# Altium project PROC101D_SCH_With_Design_Updates..Notes_V1.0.PrjPcb (part 13 of 23)

## Sheet 29.SchDoc
size 513 x 386 mm
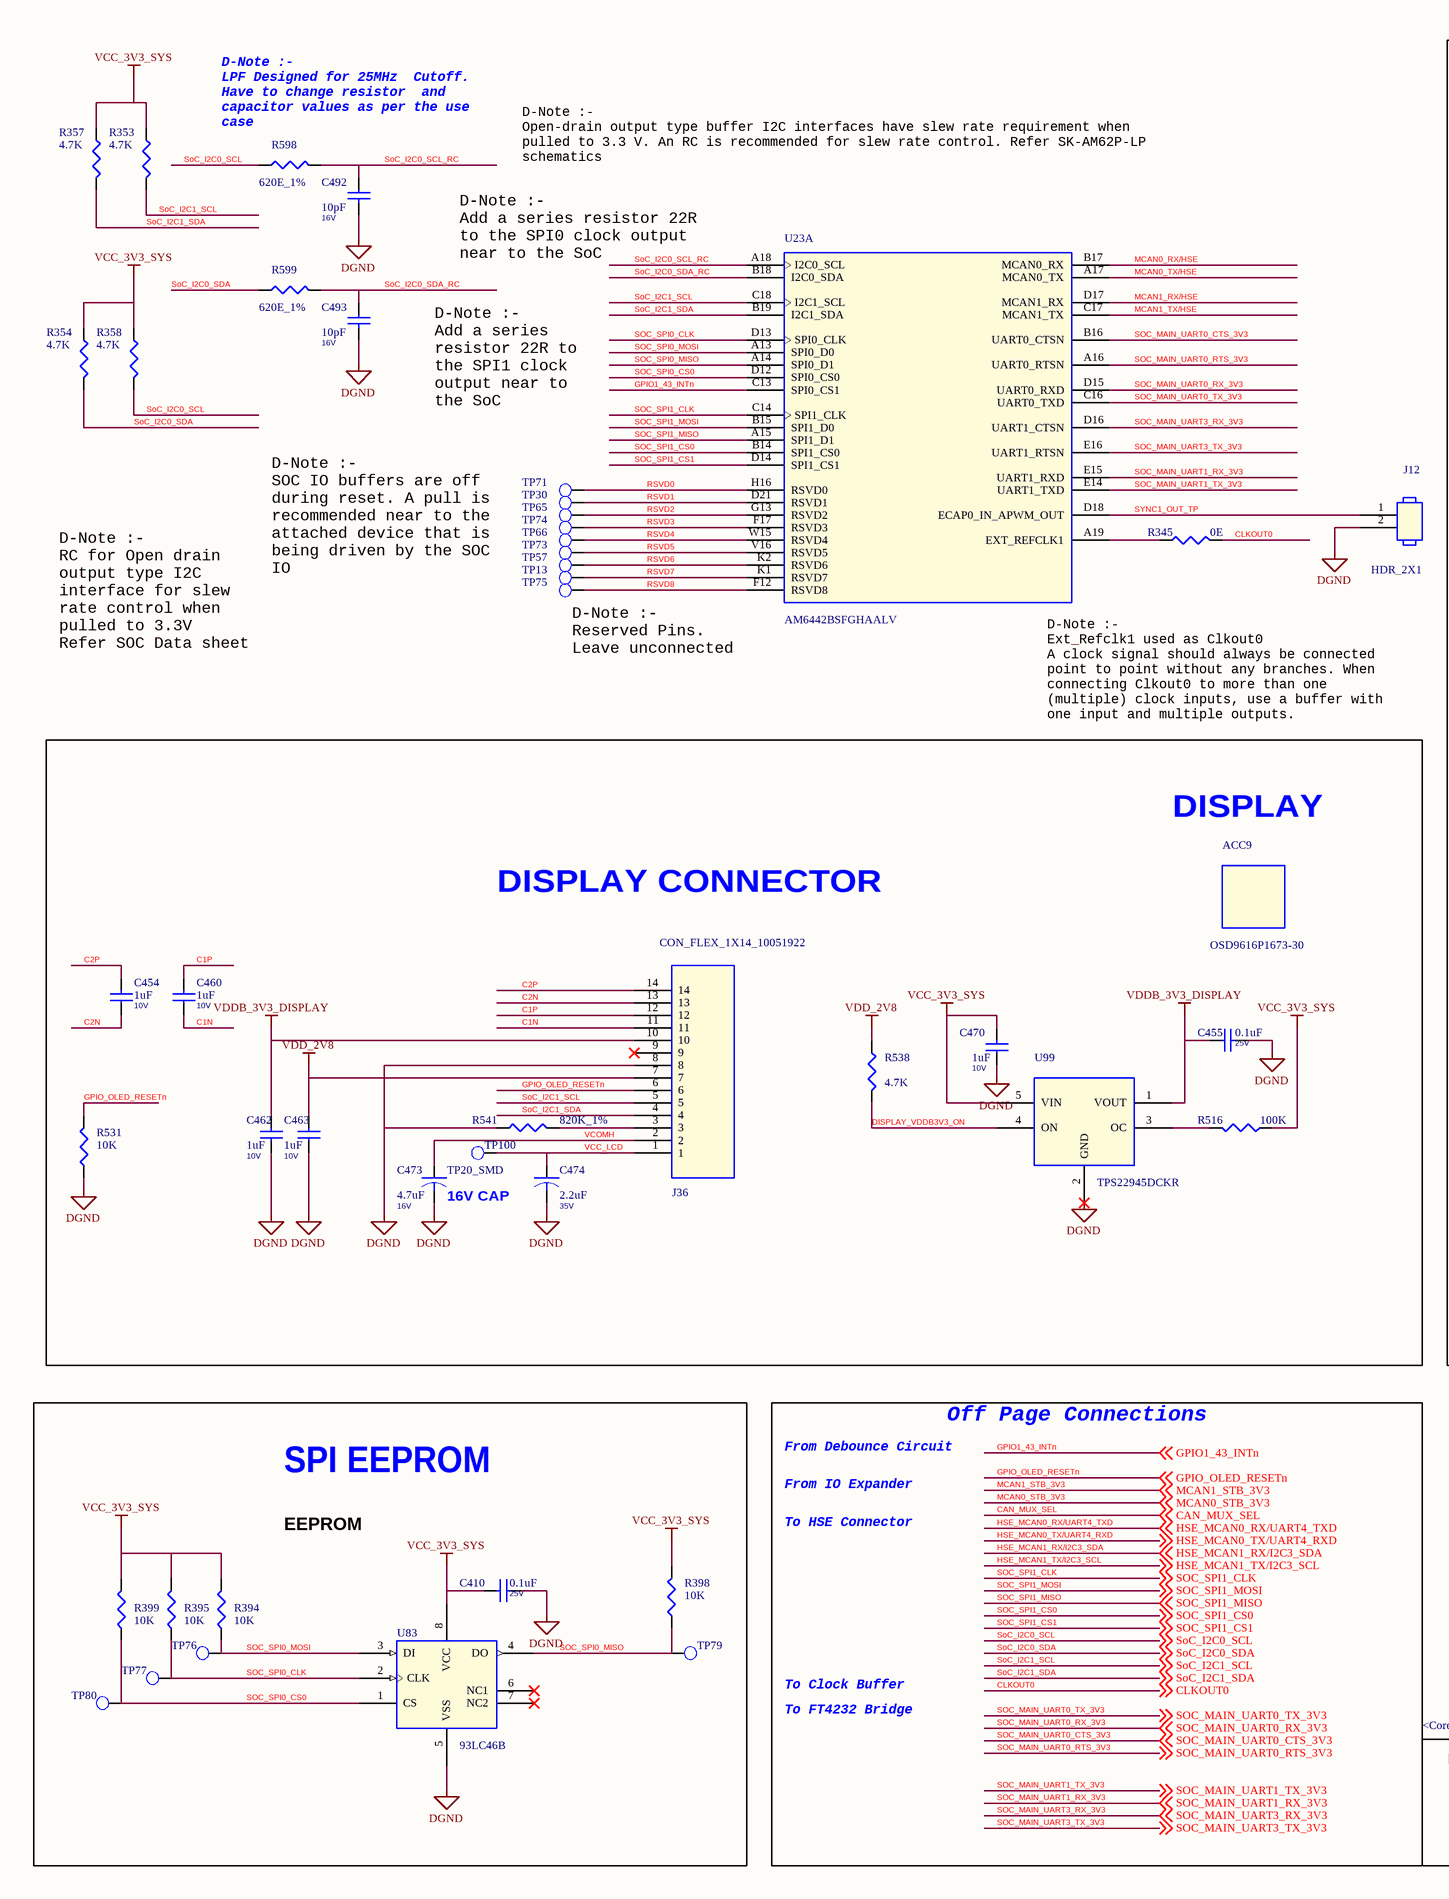
[diagram p52: 29.SchDoc, left]
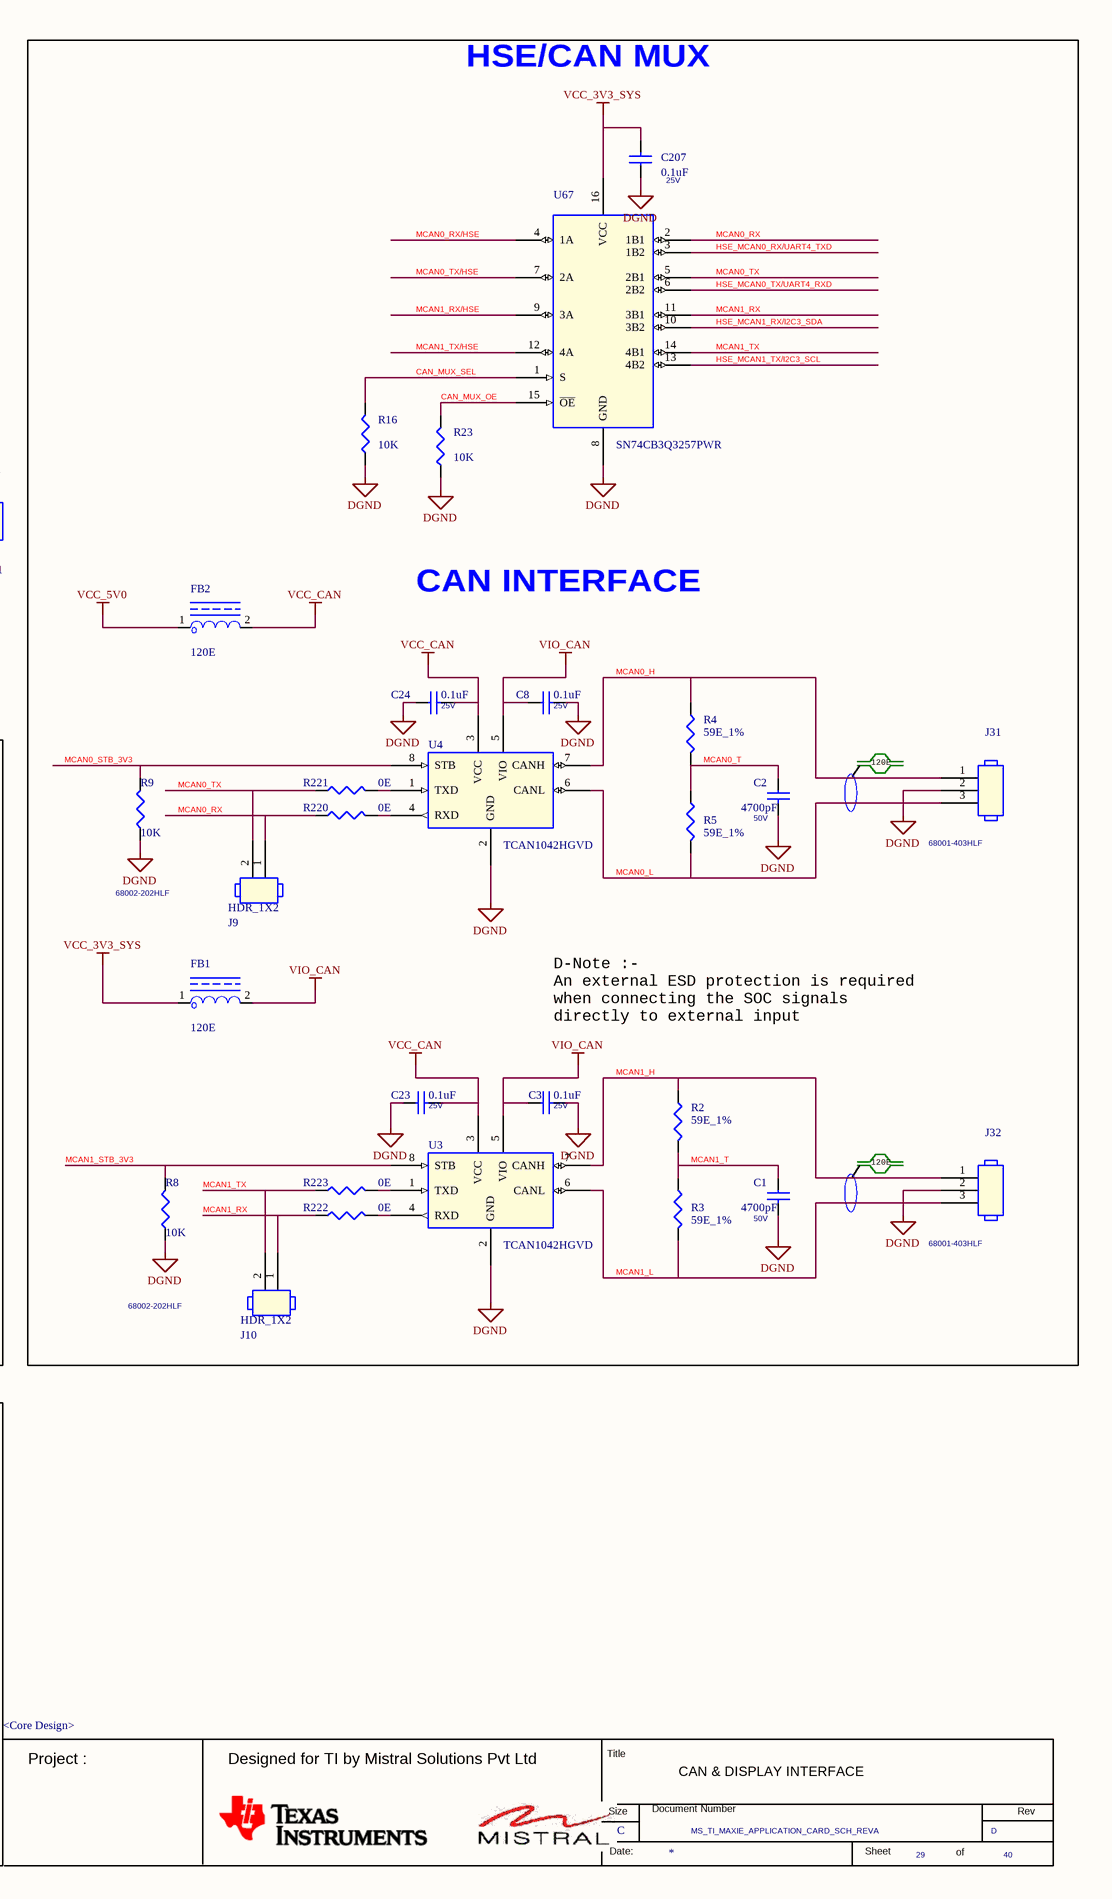
[diagram p53: 29.SchDoc, right]

### Parts
(Parts that share a designator on the sheet are numbered #1, #2 ... from top to bottom, then left to right.)
*#29  Doc: MS_TI_MAXIE_APPLICATION_CARD_SCH_REVA  RevCode: D  Title: CAN & DISPLAY INTERFACE  Page Size: C  Page Number: 29  Page Count: 40  Variant Name: <Core Design>  (hidden comment: TI_TITLEBLK_CSIZE)  (graphical)
ACC9  OSD9616P1673-30  [NA]
C1  4700pF  Voltage: 50V  [CAP0402_0-75]
C2  4700pF  Voltage: 50V  [CAP0402_0-75]
C3  0.1uF  Voltage: 25V  [CAP0402_0-75]
C8  0.1uF  Voltage: 25V  [CAP0402_0-75]
C23  0.1uF  Voltage: 25V  [CAP0402_0-75]
C24  0.1uF  Voltage: 25V  [CAP0402_0-75]
C207  0.1uF  Voltage: 25V  [CAP0402_0-75]
C410  0.1uF  Voltage: 25V  [CAP0402_0-75]
C454  1uF  Voltage: 10V  [CAP0402_0-75]
C455  0.1uF  Voltage: 25V  [CAP0402_0-75]
C460  1uF  Voltage: 10V  [CAP0402_0-75]
C462  1uF  Voltage: 10V  [CAP0402_0-75]
C463  1uF  Voltage: 10V  [CAP0402_0-75]
C470  1uF  Voltage: 10V  [CAP0402_0-75]
C473  4.7uF  Voltage: 16V  [CAP0603_1]
C474  2.2uF  Voltage: 35V  [CAP0603_1]
C492  10pF  Voltage: 16V  [CAP0402_0-75]
C493  10pF  Voltage: 16V  [CAP0402_0-75]
FB1  120E  [IND0603_1]
FB2  120E  [IND0603_1]
J9  HDR_1X2  Mfr_part_number: 68002-202HLF  [HDR_1X2_68002-202_S_T_8-6]
J10  HDR_1X2  Mfr_part_number: 68002-202HLF  [HDR_1X2_68002-202_S_T_8-6]
J12  HDR_2X1  [HDR_2X1_100_S_T]
J31  Mfr_part_number: 68001-403HLF  [HDR_3X1_100_S_T]  (hidden comment: HDR_1X3)
J32  Mfr_part_number: 68001-403HLF  [HDR_3X1_100_S_T]  (hidden comment: HDR_1X3)
J36  CON_FLEX_1X14_10051922  [CON_FLEX1X14_10051922_S_R_S]
R2  59E_1%  [RES0402_0-5]
R3  59E_1%  [RES0402_0-5]
R4  59E_1%  [RES0402_0-5]
R5  59E_1%  [RES0402_0-5]
R8  10K  [RES0402_0-5]
R9  10K  [RES0402_0-5]
R16  10K  [RES0402_0-5]
R23  10K  [RES0402_0-5]
R220  0E  [RES0402_0-5]
R221  0E  [RES0402_0-5]
R222  0E  [RES0402_0-5]
R223  0E  [RES0402_0-5]
R345  0E  [RES0402_0-5]
R353  4.7K  [RES0402_0-5]
R354  4.7K  [RES0402_0-5]
R357  4.7K  [RES0402_0-5]
R358  4.7K  [RES0402_0-5]
R394  10K  [RES0402_0-5]
R395  10K  [RES0402_0-5]
R398  10K  [RES0402_0-5]
R399  10K  [RES0402_0-5]
R516  100K  [RES0402_0-5]
R531  10K  [RES0402_0-5]
R538  4.7K  [RES0402_0-5]
R541  820K_1%  [RES0402_0-5]
R598  620E_1%  [RES0402_0-5]
R599  620E_1%  [RES0402_0-5]
TP13  TP20_SMD  [TP20_SMD]  (value not drawn)
TP30  TP20_SMD  [TP20_SMD]  (value not drawn)
TP57  TP20_SMD  [TP20_SMD]  (value not drawn)
TP65  TP20_SMD  [TP20_SMD]  (value not drawn)
TP66  TP20_SMD  [TP20_SMD]  (value not drawn)
TP71  TP20_SMD  [TP20_SMD]  (value not drawn)
TP73  TP20_SMD  [TP20_SMD]  (value not drawn)
TP74  TP20_SMD  [TP20_SMD]  (value not drawn)
TP75  TP20_SMD  [TP20_SMD]  (value not drawn)
TP76  TP20_SMD  [TP20_SMD]  (value not drawn)
TP77  TP20_SMD  [TP20_SMD]  (value not drawn)
TP79  TP20_SMD  [TP20_SMD]  (value not drawn)
TP80  TP20_SMD  [TP20_SMD]  (value not drawn)
TP100  TP20_SMD  [TP20_SMD]
U3  TCAN1042HGVD  [SOIC8_1-8]
U4  TCAN1042HGVD  [SOIC8_1-8]
U23  AM6442BSFGHAALV  [FCBGA441_31-49_680X680_2-6]  (part A of 16)
U67  SN74CB3Q3257PWR  [TSSOP16_25-59_205X180]
U83  93LC46B  [MSOP8_25-59_125X125_1-1]
U99  TPS22945DCKR  [SC70-5_1-1]

### Blocks framed on the sheet
SPI EEPROM: C410 R394 R395 R398 R399 TP76 TP77 TP79 TP80 U83

### Nets
DGND: C1.2 C2.2 C3.2 C8.2 C23.1 C24.1 C207.1 C410.1 C455.2 C462.1 C463.1 C470.1 C473.2 C474.2 C492.2 C493.2 J12.2 J31.2 J32.2 J36.8 R8.1 R9.1 R16.2 R23.2 R531.1 R541.1 U3.2(GND) U4.2(GND) U67.8(GND) U83.5(VSS) U99.2(GND)
VCC_3V3_SYS: C207.2 C410.2 C470.2 FB1.1 R353.1 R354.1 R357.1 R358.1 R394.2 R395.2 R398.2 R399.2 R516.1 U67.16(VCC) U83.8(VCC) U99.5(VIN)
VCC_5V0: FB2.1
VCC_CAN: C23.2 C24.2 FB2.2 U3.3(VCC) U4.3(VCC)
VDD_2V8: C463.2 J36.7 R538.1
VDDB_3V3_DISPLAY: C455.1 C462.2 J36.10 U99.1(VOUT)
VIO_CAN: C3.1 C8.1 FB1.2 U3.5(VIO) U4.5(VIO)
C1N: C460.1 J36.11
C1P: C460.2 J36.12
C2N: C454.1 J36.13
C2P: C454.2 J36.14
CAN_MUX_OE: R23.1 U67.15(~{OE})
CAN_MUX_SEL: R16.1 U67.1(S) ; off-sheet CAN_MUX_SEL
CLKOUT0: R345.2 ; off-sheet CLKOUT0
DISPLAY_VDDB3V3_ON: R538.2 U99.4(ON)
GPIO1_43_INTn: U23.C13(SPI0_CS1) ; off-sheet GPIO1_43_INTn
GPIO_OLED_RESETn: J36.6 R531.2 ; off-sheet GPIO_OLED_RESETn
HSE_MCAN0_RX/UART4_TXD: U67.3(1B2) ; off-sheet HSE_MCAN0_RX/UART4_TXD
HSE_MCAN0_TX/UART4_RXD: U67.6(2B2) ; off-sheet HSE_MCAN0_TX/UART4_RXD
HSE_MCAN1_RX/I2C3_SDA: U67.10(3B2) ; off-sheet HSE_MCAN1_RX/I2C3_SDA
HSE_MCAN1_TX/I2C3_SCL: U67.13(4B2) ; off-sheet HSE_MCAN1_TX/I2C3_SCL
MCAN0_H: J31.1 R4.1 U4.7(CANH)
MCAN0_L: J31.3 R5.2 U4.6(CANL)
MCAN0_RX: J9.1 R220.1 U67.2(1B1)
MCAN0_RX/HSE: U23.B17(MCAN0_RX) U67.4(1A)
MCAN0_STB_3V3: R9.2 U4.8(STB) ; off-sheet MCAN0_STB_3V3
MCAN0_T: C2.1 R4.2 R5.1
MCAN0_TX: J9.2 R221.1 U67.5(2B1)
MCAN0_TX/HSE: U23.A17(MCAN0_TX) U67.7(2A)
MCAN1_H: J32.1 R2.1 U3.7(CANH)
MCAN1_L: J32.3 R3.2 U3.6(CANL)
MCAN1_RX: J10.1 R222.1 U67.11(3B1)
MCAN1_RX/HSE: U23.D17(MCAN1_RX) U67.9(3A)
MCAN1_STB_3V3: R8.2 U3.8(STB) ; off-sheet MCAN1_STB_3V3
MCAN1_T: C1.1 R2.2 R3.1
MCAN1_TX: J10.2 R223.1 U67.14(4B1)
MCAN1_TX/HSE: U23.C17(MCAN1_TX) U67.12(4A)
RSVD0: TP71.1(TP) U23.H16(RSVD0)
RSVD1: TP30.1(TP) U23.D21(RSVD1)
RSVD2: TP65.1(TP) U23.G13(RSVD2)
RSVD3: TP74.1(TP) U23.F17(RSVD3)
RSVD4: TP66.1(TP) U23.W15(RSVD4)
RSVD5: TP73.1(TP) U23.V16(RSVD5)
RSVD6: TP57.1(TP) U23.K2(RSVD6)
RSVD7: TP13.1(TP) U23.K1(RSVD7)
RSVD8: TP75.1(TP) U23.F12(RSVD8)
SoC_I2C0_SCL: R358.2 R598.1 ; off-sheet SoC_I2C0_SCL
SoC_I2C0_SCL_RC: C492.1 R598.2 U23.A18(I2C0_SCL)
SoC_I2C0_SDA: R354.2 R599.1 ; off-sheet SoC_I2C0_SDA
SoC_I2C0_SDA_RC: C493.1 R599.2 U23.B18(I2C0_SDA)
SoC_I2C1_SCL: J36.5 R353.2 U23.C18(I2C1_SCL) ; off-sheet SoC_I2C1_SCL
SoC_I2C1_SDA: J36.4 R357.2 U23.B19(I2C1_SDA) ; off-sheet SoC_I2C1_SDA
SOC_MAIN_UART0_CTS_3V3: U23.B16(UART0_CTSN) ; off-sheet SOC_MAIN_UART0_CTS_3V3
SOC_MAIN_UART0_RTS_3V3: U23.A16(UART0_RTSN) ; off-sheet SOC_MAIN_UART0_RTS_3V3
SOC_MAIN_UART0_RX_3V3: U23.D15(UART0_RXD) ; off-sheet SOC_MAIN_UART0_RX_3V3
SOC_MAIN_UART0_TX_3V3: U23.C16(UART0_TXD) ; off-sheet SOC_MAIN_UART0_TX_3V3
SOC_MAIN_UART1_RX_3V3: U23.E15(UART1_RXD) ; off-sheet SOC_MAIN_UART1_RX_3V3
SOC_MAIN_UART1_TX_3V3: U23.E14(UART1_TXD) ; off-sheet SOC_MAIN_UART1_TX_3V3
SOC_MAIN_UART3_RX_3V3: U23.D16(UART1_CTSN) ; off-sheet SOC_MAIN_UART3_RX_3V3
SOC_MAIN_UART3_TX_3V3: U23.E16(UART1_RTSN) ; off-sheet SOC_MAIN_UART3_TX_3V3
SOC_SPI0_CLK: R395.1 TP77.1(TP) U23.D13(SPI0_CLK) U83.2(CLK)
SOC_SPI0_CS0: R399.1 TP80.1(TP) U23.D12(SPI0_CS0) U83.1(CS)
SOC_SPI0_MISO: R398.1 TP79.1(TP) U23.A14(SPI0_D1) U83.4(DO)
SOC_SPI0_MOSI: R394.1 TP76.1(TP) U23.A13(SPI0_D0) U83.3(DI)
SOC_SPI1_CLK: U23.C14(SPI1_CLK) ; off-sheet SOC_SPI1_CLK
SOC_SPI1_CS0: U23.B14(SPI1_CS0) ; off-sheet SOC_SPI1_CS0
SOC_SPI1_CS1: U23.D14(SPI1_CS1) ; off-sheet SOC_SPI1_CS1
SOC_SPI1_MISO: U23.A15(SPI1_D1) ; off-sheet SOC_SPI1_MISO
SOC_SPI1_MOSI: U23.B15(SPI1_D0) ; off-sheet SOC_SPI1_MOSI
SYNC1_OUT_TP: J12.1 U23.D18(ECAP0_IN_APWM_OUT)
VCC_LCD: C474.1 J36.1 TP100.1(TP)
VCOMH: C473.1 J36.2
NetJ36_3: J36.3 R541.2
NetR220_2: R220.2 U4.4(RXD)
NetR221_2: R221.2 U4.1(TXD)
NetR222_2: R222.2 U3.4(RXD)
NetR223_2: R223.2 U3.1(TXD)
NetR345_1: R345.1 U23.A19(EXT_REFCLK1)
NetR516_2: R516.2 U99.3(OC)

Not connected (* = marked no-connect by the designer): J36 9*; U83 6(NC1)* 7(NC2)*

### Notes on the sheet
- (near R598) D-Note :-
  LPF Designed for 25MHz  Cutoff.
  Have to change resistor  and
  capacitor values as per the use
  case
- D-Note :-
  Open-drain output type buffer I2C interfaces have slew rate requirement when
  pulled to 3.3 V. An RC is recommended for slew rate control. Refer SK-AM62P-LP
  schematics
- HSE/CAN MUX
- D-Note :-
  Add a series resistor 22R
  to the SPI0 clock output
  near to the SoC
- D-Note :-
  Add a series
  resistor 22R to
  the SPI1 clock
  output near to
  the SoC
- D-Note :-
  SOC IO buffers are off
  during reset. A pull is
  recommended near to the
  attached device that is
  being driven by the SOC
  IO
- D-Note :-
  RC for Open drain
  output type I2C
  interface for slew
  rate control when
  pulled to 3.3V
  Refer SOC Data sheet
- (near TP75) D-Note :-
  Reserved Pins.
  Leave unconnected
- (near U23) D-Note :-
  Ext_Refclk1 used as Clkout0
  A clock signal should always be connected
  point to point without any branches. When
  connecting Clkout0 to more than one
  (multiple) clock inputs, use a buffer with
  one input and multiple outputs.
- CAN INTERFACE
- 120E
- (near ACC9) DISPLAY
- DISPLAY CONNECTOR
- D-Note :-
  An external ESD protection is required
  when connecting the SOC signals
  directly to external input
- (near C473) 16V CAP
- Off Page Connections
- From IO Expander
- From Debounce Circuit
- EEPROM
- To HSE Connector
- To Clock Buffer
- To FT4232 Bridge
- (in symbol TI_TITLEBLK_CSIZE) Title; Project :; Designed for TI by Mistral Solutions Pvt Ltd; Size; Document Number; Rev; Date:; Sheet; of

### Library data of the parts
*#29 = TI_TITLEBLK_CSIZE: Issue: 1.0; Page Create Date: March  8, 1995; Page Modify Date: *
ACC9 = ACCESSORY: ACCESSORIE PASSIVE MATRIX MONOCHROME WHITE DISPLAY; Part_type: ACCESSORIES; Mfr_name: OSD DISPLAYS; Mistral Part No: 160021020059; Project: TI_AM64x_EVM; PCB Footprint: NA; Footprint Path: NA; Library Path: NA; MECHANICAL 3D STEP FILE: NA; Custom_Duty: NA; Customs_HS_Code: NA; RoHS: NA; Chkd/date: MANIRAJA/150221; Crtd /date: ALVY/150221; Datasheet: Y:\MIS_DATABASE\DATASHEETS\MISC\ACCESSORIES\OSD9616P1673-30.PDF; Temperature: -40癈+70癈; Weight: 720mg; Height: NA; Library Ref: ACCESSORY; Distributor_part_number: NA; Distributor_name: NA; Package: NA; Wattage: NA; Voltage: NA; Tolerance: NA; Mfr_part_number: OSD9616P1673-30; Footprint Ref: NA
C1 = CAP_Dup3: CAP CERAMIC 4700pF 50V 10% X7R 0402; Mistral Part No: 120009030440-R; Mfr_name: WURTH ELECTRONICS; Mfr_part_number: 885012205065; Part_type: CAPACITORS\CERAMIC; Project: AM64x_EVM_BRD; Wattage: NA; Customs_HS_Code: 85322990; Custom_Duty: 15%; PCB Footprint: CAP0402_0-75; Footprint Ref: CAP0402_0-75; Tolerance: 10%; Package: 0402; Distributor_name: DIGIKEY; Distributor_part_number: 732-7560-1-ND; Library Ref: CAP; Height: 0.55MM; Weight: 12mg; Temperature: -55癈+125癈; Datasheet: Y:\MIS_DATABASE\DATASHEETS\CAPACITORS\885012205065.PDF; Crtd /date: ALVY/170820; Chkd/date: MANIRAJA/170820; MECHANICAL 3D STEP FILE: CAP0402_0-75; Library Path: Y:\MIS_DATABASE\Library\ALTIUM_TOOL\SCHEMATICS_PARTS\MS_DISCRETE_Library.schlib; Footprint Path: Y:\MIS_DATABASE\Library\ALTIUM_TOOL\PCB_FOOTPRINTS\Altium_Footprint_Lib.PcbLib
C2 = CAP_Dup3: CAP CERAMIC 4700pF 50V 10% X7R 0402; Part_type: CAPACITORS\CERAMIC; Mfr_part_number: 885012205065; Mfr_name: WURTH ELECTRONICS; Mistral Part No: 120009030440-R; Custom_Duty: 15%; Customs_HS_Code: 85322990; Wattage: NA; Project: AM64x_EVM_BRD; PCB Footprint: CAP0402_0-75; Footprint Path: Y:\MIS_DATABASE\Library\ALTIUM_TOOL\PCB_FOOTPRINTS\Altium_Footprint_Lib.PcbLib; Library Path: Y:\MIS_DATABASE\Library\ALTIUM_TOOL\SCHEMATICS_PARTS\MS_DISCRETE_Library.schlib; MECHANICAL 3D STEP FILE: CAP0402_0-75; Chkd/date: MANIRAJA/170820; Crtd /date: ALVY/170820; Datasheet: Y:\MIS_DATABASE\DATASHEETS\CAPACITORS\885012205065.PDF; Temperature: -55癈+125癈; Weight: 12mg; Height: 0.55MM; Library Ref: CAP; Distributor_part_number: 732-7560-1-ND; Distributor_name: DIGIKEY; Package: 0402; Tolerance: 10%; Footprint Ref: CAP0402_0-75
C3 C24 C455 = CAP_Dup3: as C19 on sheet 27; PCB Footprint: CAP0402_0-75; Tolerance: 20%; Package: 0402; Distributor_name: DIGIKEY; Distributor_part_number: 732-7495-1-ND; Height: 0.55MM; Weight: 0.65mg; Temperature: -55癈+85癈; Datasheet: Y:\MIS_DATABASE\DATASHEETS\CAPACITORS\885012105018.PDF; Crtd /date: ALVY/170820; Chkd/date: MANIRAJA/170820; MECHANICAL 3D STEP FILE: CAP0402_0-75; Library Ref: CAP; Footprint Ref: CAP0402_0-75; Library Path: Y:\MIS_DATABASE\Library\ALTIUM_TOOL\SCHEMATICS_PARTS\MS_DISCRETE_Library.schlib; Footprint Path: Y:\MIS_DATABASE\Library\ALTIUM_TOOL\PCB_FOOTPRINTS\Altium_Footprint_Lib.PcbLib
C8 C23 C207 C410 = CAP_Dup3: as C12-C14 on sheet 27; PCB Footprint: CAP0402_0-75; Footprint Path: Y:\MIS_DATABASE\Library\ALTIUM_TOOL\PCB_FOOTPRINTS\Altium_Footprint_Lib.PcbLib; Library Path: Y:\MIS_DATABASE\Library\ALTIUM_TOOL\SCHEMATICS_PARTS\MS_DISCRETE_Library.schlib; Footprint Ref: CAP0402_0-75; Library Ref: CAP; MECHANICAL 3D STEP FILE: CAP0402_0-75; Chkd/date: MANIRAJA/170820; Crtd /date: ALVY/170820; Datasheet: Y:\MIS_DATABASE\DATASHEETS\CAPACITORS\885012105018.PDF; Temperature: -55癈+85癈; Weight: 0.65mg; Height: 0.55MM; Distributor_part_number: 732-7495-1-ND; Distributor_name: DIGIKEY; Package: 0402; Tolerance: 20%
C454 C460 C462 C470 = CAP_Dup3: as C15 on sheet 27; PCB Footprint: CAP0402_0-75; Tolerance: 20%; Package: 0402; Distributor_name: DIGIKEY; Distributor_part_number: 732-7489-1-ND; Height: 0.55MM; Weight: 0.65mg; Temperature: -55癈+85癈; Datasheet: Y:\MIS_DATABASE\DATASHEETS\CAPACITORS\885012105012.PDF; Crtd /date: ALVY/190820; Chkd/date: MANIRAJA/210820; MECHANICAL 3D STEP FILE: CAP0402_0-75; Library Path: Y:\MIS_DATABASE\Library\ALTIUM_TOOL\SCHEMATICS_PARTS\MS_DISCRETE_Library.schlib; Footprint Path: Y:\MIS_DATABASE\Library\ALTIUM_TOOL\PCB_FOOTPRINTS\Altium_Footprint_Lib.PcbLib; Library Ref: CAP; Footprint Ref: CAP0402_0-75
C463 = CAP_Dup3: as C212 on sheet 27; PCB Footprint: CAP0402_0-75; Footprint Ref: CAP0402_0-75; Library Ref: CAP; Footprint Path: Y:\MIS_DATABASE\Library\ALTIUM_TOOL\PCB_FOOTPRINTS\Altium_Footprint_Lib.PcbLib; Library Path: Y:\MIS_DATABASE\Library\ALTIUM_TOOL\SCHEMATICS_PARTS\MS_DISCRETE_Library.schlib; MECHANICAL 3D STEP FILE: CAP0402_0-75; Chkd/date: MANIRAJA/210820; Crtd /date: ALVY/190820; Datasheet: Y:\MIS_DATABASE\DATASHEETS\CAPACITORS\885012105012.PDF; Temperature: -55癈+85癈; Weight: 0.65mg; Height: 0.55MM; Distributor_part_number: 732-7489-1-ND; Distributor_name: DIGIKEY; Package: 0402; Tolerance: 20%
C473 = CAP_Dup1: CAP CERAMIC 4.7uF 16V 10% X5R 0603; Part_type: CAPACITORS\CERAMIC; Mfr_part_number: CC0603KRX5R7BB475; Mfr_name: YAGEO AMERICA; Mistral Part No: 120011050004-R; Custom_Duty: 15%; Customs_HS_Code: 85322990; Wattage: NA; Project: ASL_LIU_TYPE-II; PCB Footprint: CAP0603_1; Footprint Path: Y:\MIS_DATABASE\Library\ALTIUM_TOOL\PCB_FOOTPRINTS\Altium_Footprint_Lib.PcbLib; Library Path: Y:\MIS_DATABASE\Library\ALTIUM_TOOL\SCHEMATICS_PARTS\MS_DISCRETE_Library.schlib; MECHANICAL 3D STEP FILE: CAP0603_1; Chkd/date: MANIRAJA/131217; Crtd /date: ALVY/131217; Datasheet: Y:\MIS_DATABASE\DATASHEETS\CAPACITORS\YACC-X5R.PDF; Temperature: -55癈+85癈; Weight: 2mg; Height: 0.95MM; Library Ref: CAP; Distributor_part_number: 311-1785-1-ND; Distributor_name: DIGIKEY; Package: 0603; Tolerance: 10%; Footprint Ref: CAP0603_1
C474 = CAP_Dup1: CAP CERAMIC 2.2uF 35V 10% X5R 0603; Mistral Part No: 120017010016-R; Mfr_name: MURATA; Mfr_part_number: GRM188R6YA225KA12D; Part_type: CAPACITORS\CERAMIC; Project: SD820_NANO_SOM; Wattage: NA; Customs_HS_Code: 85322990; Custom_Duty: 15%; PCB Footprint: CAP0603_1; Library Ref: CAP; Tolerance: 10%; Package: 0603; Distributor_name: DIGIKEY; Distributor_part_number: 490-7204-1-ND; Height: 0.90MM; Weight: 6.3mg; Temperature: -55癈+85癈; Datasheet: Y:\MIS_DATABASE\DATASHEETS\CAPACITORS\MURATA-GXX-SER_NOV17.PDF; Crtd /date: MANIRAJA/270117; Chkd/date: VASANTHA/270117; MECHANICAL 3D STEP FILE: CAP0603_1; Footprint Ref: CAP0603_1; Library Path: Y:\MIS_DATABASE\Library\ALTIUM_TOOL\SCHEMATICS_PARTS\MS_DISCRETE_Library.schlib; Footprint Path: Y:\MIS_DATABASE\Library\ALTIUM_TOOL\PCB_FOOTPRINTS\Altium_Footprint_Lib.PcbLib
C492 C493 = CAP_Dup3: CAP CERAMIC 10pF 16V 5% C0G(NP0) 0402; Part_type: CAPACITORS\CERAMIC; Mfr_part_number: 885012005025; Mfr_name: WURTH ELECTRONICS; Mistral Part No: 120018030015-R; Custom_Duty: 15%; Customs_HS_Code: 85322990; Wattage: NA; Project: SMART-M_SCRIPTALK_PB; PCB Footprint: CAP0402_0-75; Footprint Path: Y:\MIS_DATABASE\Library\ALTIUM_TOOL\PCB_FOOTPRINTS\Altium_Footprint_Lib.PcbLib; Library Path: Y:\MIS_DATABASE\Library\ALTIUM_TOOL\SCHEMATICS_PARTS\MS_DISCRETE_Library.schlib; MECHANICAL 3D STEP FILE: CAP0402_0-75; Chkd/date: MANIRAJA/100918; Crtd /date: ALVY/100918; Datasheet: Y:\MIS_DATABASE\DATASHEETS\CAPACITORS\885012005025.PDF; Temperature: -55癈+125癈; Weight: 0.65mg; Height: 0.55MM; Library Ref: CAP; Distributor_part_number: 732-7441-1-ND; Distributor_name: DIGIKEY; Package: 0402; Tolerance: 5%; Footprint Ref: CAP0402_0-75
FB1 FB2 = INDUCTOR_FERRITE: IND FERRITE BEAD CHIP 120E 2A 0603; Mistral Part No: 130020080015-R; Mfr_name: WURTH ELECTRONICS; Mfr_part_number: 782631141; Project: AM64x_EVM_BRD; Tolerance: 25%; Voltage: NA; Customs_HS_Code: 85437099; Custom_Duty: 24%; Footprint Ref: IND0603_1; Part_type: INDUCTOR; Wattage: NA; Package: 0603; Distributor_name: DIGIKEY; Distributor_part_number: 732-782631141CT-ND; Library Ref: INDUCTOR_FERRITE; Height: 1.00MM; Weight: NA; Temperature: -55癈+125癈; Datasheet: Y:\MIS_DATABASE\DATASHEETS\DISCRETES\INDUCTORS\782631141.PDF; Crtd /date: ALVY/180820; Chkd/date: MANIRAJA/180820; MECHANICAL 3D STEP FILE: IND0603_1; Library Path: Y:\MIS_DATABASE\Library\ALTIUM_TOOL\SCHEMATICS_PARTS\MS_FILTER_Library.schlib; Footprint Path: Y:\MIS_DATABASE\Library\ALTIUM_TOOL\PCB_FOOTPRINTS\Altium_Footprint_Lib.PcbLib; PCB Footprint: IND0603_1
J9 = HEADER_2X1_Dup1: CON HDR 1X2 2.54MM PITCH ST TH; Part_type: CONNECTOR\HEADERS; Mfr_name: AMPHENOL; Mistral Part No: 150018010012-R; Custom_Duty: 24%; Customs_HS_Code: 85369090; Wattage: NA; Project: TI_SVB_MAXWELL_DUT; MECHANICAL 3D STEP FILE: HDR_1X2_68002-202_S_T_8-6; Chkd/date: MANIRAJA/190118; Crtd /date: ALVY/190118; Datasheet: Y:\MIS_DATABASE\DATASHEETS\CONNECTORS\68002.PDF; Temperature: NA; Weight: NA; Height: 8.58MM; Library Ref: HEADER_2X1; Distributor_part_number: 68002-202HLF-ND; Distributor_name: DIGIKEY; Package: THRU HOLE; Voltage: NA; Tolerance: NA; PCB Footprint: HDR_1X2_68002-202_S_T_8-6
J10 = HEADER_2X1_Dup1: CON HDR 1X2 2.54MM PITCH ST TH; Mistral Part No: 150018010012-R; Mfr_name: AMPHENOL; Part_type: CONNECTOR\HEADERS; Project: TI_SVB_MAXWELL_DUT; Tolerance: NA; Customs_HS_Code: 85369090; Custom_Duty: 24%; Voltage: NA; Wattage: NA; Package: THRU HOLE; Distributor_name: DIGIKEY; Distributor_part_number: 68002-202HLF-ND; Library Ref: HEADER_2X1; Height: 8.58MM; Weight: NA; Temperature: NA; Datasheet: Y:\MIS_DATABASE\DATASHEETS\CONNECTORS\68002.PDF; Crtd /date: ALVY/190118; Chkd/date: MANIRAJA/190118; MECHANICAL 3D STEP FILE: HDR_1X2_68002-202_S_T_8-6; PCB Footprint: HDR_1X2_68002-202_S_T_8-6
J12 = HEADER_2X1: CON HDR 2X1 2.54MM PITCH ST TH; Part_type: CONNECTOR\HEADERS; Mfr_part_number: 90120-0122; Mfr_name: MOLEX; Mistral Part No: 150012100005-R; Custom_Duty: 24%; Customs_HS_Code: 85369090; Wattage: NA; Project: NPOL_FEP; PCB Footprint: HDR_2X1_100_S_T; Chkd/date: NAVEED/210714; Crtd /date: USMAN/031012; Datasheet: Y:\MIS_DATABASE\DATASHEETS\CONNECTORS\90120-SERIES.PDF; Temperature: -55癈+125癈; Weight: NA; Height: 5.60MM; Library Ref: HEADER_2X1; Distributor_part_number: WM8072-ND; Distributor_name: DIGIKEY; Package: THRU-HOLE; Voltage: NA; Tolerance: NA
J31 J32 = HEADER_3X1: HDR 1X3 2.54MM PITCH ST TH; Mistral Part No: 150016060025-R; Mfr_name: FCI; Part_type: CONNECTOR\HEADERS; Project: IKEYP; Tolerance: NA; Customs_HS_Code: 85322990; Custom_Duty: 15%; PCB Footprint: HDR_3X1_100_S_T; Voltage: NA; Wattage: NA; Package: THRU-HOLE; Distributor_name: DIGIKEY; Distributor_part_number: 609-3471-ND; Library Ref: HEADER_3X1; Height: 8.58MM; Weight: NA; Temperature: -40癈+105癈; Datasheet: Y:\MIS_DATABASE\DATASHEETS\CONNECTORS\68000.PDF; Crtd /date: VASANTHA/290616; Chkd/date: VASANTHA/290616
J36 = CON_FLEX_14X1_FH19: CON FPC 1X14 0.50MM PITCH RT SMD; Part_type: CONNECTOR\FPC; Mfr_part_number: 10051922-1410ELF; Mfr_name: FCI; Mistral Part No: 150015110023-R; Custom_Duty: 24%; Customs_HS_Code: 85369090; Wattage: NA; Project: TI_C5545; PCB Footprint: CON_FLEX1X14_10051922_S_R_S; Chkd/date: VASANTHA/261115; Crtd /date: VASANTHA/261115; Datasheet: Y:\MIS_DATABASE\DATASHEETS\CONNECTORS\10051922.PDF; Temperature: NA; Weight: NA; Height: 1.50MM; Library Ref: CON_FLEX_14X1_FH19; Distributor_part_number: 609-1237-1-ND; Distributor_name: DIGIKEY; Package: SMD; Voltage: NA; Tolerance: NA
R2 R3 R5 = RESISTOR_Dup6: RES 59E 1/10W 1% 0402; Part_type: RESISTORS\FIXED; Mfr_part_number: ERJ-2RKF59R0X; Mfr_name: PANASONIC-ECG; Mistral Part No: 110009031010-R; Custom_Duty: 15%; Customs_HS_Code: 85332119; Voltage: NA; Project: KHAN_HSST; Footprint Path: Y:\MIS_DATABASE\Library\ALTIUM_TOOL\PCB_FOOTPRINTS\Altium_Footprint_Lib.PcbLib; Library Path: Y:\MIS_DATABASE\Library\ALTIUM_TOOL\SCHEMATICS_PARTS\MS_DISCRETE_Library.schlib; MECHANICAL 3D STEP FILE: RES0402_0-5; Chkd/date: MAZHAR/151208; Crtd /date: USMAN/031208; Datasheet: Y:\MIS_DATABASE\DATASHEETS\RESISTORS\PAN-ERJSER_NOV17.PDF; Temperature: -55癈+155癈; Weight: 0.8mg; Height: 0.40MM; Footprint Ref: RES0402_0-5; Library Ref: RESISTOR; Distributor_part_number: P59.0LCT-ND; Distributor_name: DIGIKEY; Package: 0402; Wattage: 1/10W; Tolerance: 1%; PCB Footprint: RES0402_0-5
R4 = RESISTOR_Dup6: RES 59E 1/10W 1% 0402; Mistral Part No: 110009031010-R; Mfr_name: PANASONIC-ECG; Mfr_part_number: ERJ-2RKF59R0X; Part_type: RESISTORS\FIXED; Project: KHAN_HSST; Voltage: NA; Customs_HS_Code: 85332119; Custom_Duty: 15%; Tolerance: 1%; Wattage: 1/10W; Package: 0402; Distributor_name: DIGIKEY; Distributor_part_number: P59.0LCT-ND; Library Ref: RESISTOR; Footprint Ref: RES0402_0-5; Height: 0.40MM; Weight: 0.8mg; Temperature: -55癈+155癈; Datasheet: Y:\MIS_DATABASE\DATASHEETS\RESISTORS\PAN-ERJSER_NOV17.PDF; Crtd /date: USMAN/031208; Chkd/date: MAZHAR/151208; MECHANICAL 3D STEP FILE: RES0402_0-5; Library Path: Y:\MIS_DATABASE\Library\ALTIUM_TOOL\SCHEMATICS_PARTS\MS_DISCRETE_Library.schlib; Footprint Path: Y:\MIS_DATABASE\Library\ALTIUM_TOOL\PCB_FOOTPRINTS\Altium_Footprint_Lib.PcbLib; PCB Footprint: RES0402_0-5
R8 R9 R394 R395 R398 = RESISTOR_Dup6: RES 10K 1/16W 5% 0402; Mistral Part No: 110011060021-R; Mfr_name: YAGEO AMERICA; Mfr_part_number: RC0402JR-0710KL; Part_type: RESISTORS\FIXED; Project: HSE; Voltage: NA; Customs_HS_Code: 85332119; Custom_Duty: 15%; PCB Footprint: RES0402_0-5; Footprint Path: Y:\MIS_DATABASE\Library\ALTIUM_TOOL\PCB_FOOTPRINTS\Altium_Footprint_Lib.PcbLib; Library Path: Y:\MIS_DATABASE\Library\ALTIUM_TOOL\SCHEMATICS_PARTS\MS_DISCRETE_Library.schlib; Footprint Ref: RES0402_0-5; Library Ref: RESISTOR; Tolerance: 5%; Wattage: 1/16W; Package: 0402; Distributor_name: DIGIKEY; Distributor_part_number: 311-10KJRCT-ND; Height: 0.40MM; Weight: 0.65mg; Temperature: -55癈+155癈; Datasheet: Y:\MIS_DATABASE\DATASHEETS\RESISTORS\RCXXXXL-SER_MAR18.PDF; Crtd /date: MAZHAR/230805; Chkd/date: VASANTHA/061216; MECHANICAL 3D STEP FILE: RES0402_0-5
R16 R23 R399 R531 = RESISTOR_Dup6: as R21 on sheet 28; PCB Footprint: RES0402_0-5; Footprint Path: Y:\MIS_DATABASE\Library\ALTIUM_TOOL\PCB_FOOTPRINTS\Altium_Footprint_Lib.PcbLib; Library Path: Y:\MIS_DATABASE\Library\ALTIUM_TOOL\SCHEMATICS_PARTS\MS_DISCRETE_Library.schlib; Footprint Ref: RES0402_0-5; Library Ref: RESISTOR; MECHANICAL 3D STEP FILE: RES0402_0-5; Chkd/date: VASANTHA/061216; Crtd /date: MAZHAR/230805; Datasheet: Y:\MIS_DATABASE\DATASHEETS\RESISTORS\RCXXXXL-SER_MAR18.PDF; Temperature: -55癈+155癈; Weight: 0.65mg; Height: 0.40MM; Distributor_part_number: 311-10KJRCT-ND; Distributor_name: DIGIKEY; Package: 0402; Wattage: 1/16W; Tolerance: 5%
R220 R221 R223 = RESISTOR_Dup6: RES 0E 1/16W JUMPER 0402; Mistral Part No: 110010080019-R; Mfr_name: VISHAY; Mfr_part_number: CRCW04020000Z0ED; Part_type: RESISTORS\FIXED; Project: PB_BUGBASE; Tolerance: NA; Customs_HS_Code: 85332119; Custom_Duty: 15%; PCB Footprint: RES0402_0-5; Voltage: NA; Wattage: 1/16W; Package: 0402; Distributor_name: DIGIKEY; Distributor_part_number: 541-0.0JCT-ND; Height: 0.40MM; Weight: 0.65mg; Temperature: -55癈+155癈; Datasheet: Y:\MIS_DATABASE\DATASHEETS\RESISTORS\CRCW0603.PDF; Crtd /date: MUDDU/190810; Chkd/date: VASANTHA/201216; MECHANICAL 3D STEP FILE: RES0402_0-5; Footprint Ref: RES0402_0-5; Library Ref: RESISTOR; Library Path: Y:\MIS_DATABASE\Library\ALTIUM_TOOL\SCHEMATICS_PARTS\MS_DISCRETE_Library.schlib; Footprint Path: Y:\MIS_DATABASE\Library\ALTIUM_TOOL\PCB_FOOTPRINTS\Altium_Footprint_Lib.PcbLib
R222 = RESISTOR_Dup6: RES 0E 1/16W JUMPER 0402; Part_type: RESISTORS\FIXED; Mfr_part_number: CRCW04020000Z0ED; Mfr_name: VISHAY; Mistral Part No: 110010080019-R; Custom_Duty: 15%; Customs_HS_Code: 85332119; Voltage: NA; Project: PB_BUGBASE; PCB Footprint: RES0402_0-5; Footprint Path: Y:\MIS_DATABASE\Library\ALTIUM_TOOL\PCB_FOOTPRINTS\Altium_Footprint_Lib.PcbLib; Library Path: Y:\MIS_DATABASE\Library\ALTIUM_TOOL\SCHEMATICS_PARTS\MS_DISCRETE_Library.schlib; Library Ref: RESISTOR; Footprint Ref: RES0402_0-5; MECHANICAL 3D STEP FILE: RES0402_0-5; Chkd/date: VASANTHA/201216; Crtd /date: MUDDU/190810; Datasheet: Y:\MIS_DATABASE\DATASHEETS\RESISTORS\CRCW0603.PDF; Temperature: -55癈+155癈; Weight: 0.65mg; Height: 0.40MM; Distributor_part_number: 541-0.0JCT-ND; Distributor_name: DIGIKEY; Package: 0402; Wattage: 1/16W; Tolerance: NA
R345 = RESISTOR_Dup5: as R390-R392 on sheet 28; PCB Footprint: RES0402_0-5; Footprint Path: Y:\MIS_DATABASE\Library\ALTIUM_TOOL\PCB_FOOTPRINTS\Altium_Footprint_Lib.PcbLib; Library Path: Y:\MIS_DATABASE\Library\ALTIUM_TOOL\SCHEMATICS_PARTS\MS_DISCRETE_Library.schlib; Footprint Ref: RES0402_0-5; Library Ref: RESISTOR; MECHANICAL 3D STEP FILE: RES0402_0-5; Chkd/date: VASANTHA/201216; Crtd /date: MUDDU/190810; Datasheet: Y:\MIS_DATABASE\DATASHEETS\RESISTORS\CRCW0603.PDF; Temperature: -55癈+155癈; Weight: 0.65mg; Height: 0.40MM; Distributor_part_number: 541-0.0JCT-ND; Distributor_name: DIGIKEY; Package: 0402; Wattage: 1/16W; Tolerance: NA
R353 R357 = RESISTOR_Dup6: RES 4.7K 1/16W 5% 0402; Mistral Part No: 110011060001-R; Mfr_name: YAGEO AMERICA; Mfr_part_number: RC0402JR-074K7L; Part_type: RESISTORS\FIXED; Project: TMDXCSK368; Voltage: NA; Customs_HS_Code: 85332119; Custom_Duty: 15%; Footprint Path: Y:\MIS_DATABASE\Library\ALTIUM_TOOL\PCB_FOOTPRINTS\Altium_Footprint_Lib.PcbLib; Library Path: Y:\MIS_DATABASE\Library\ALTIUM_TOOL\SCHEMATICS_PARTS\MS_DISCRETE_Library.schlib; MECHANICAL 3D STEP FILE: RES0402_0-5; Footprint Ref: RES0402_0-5; Tolerance: 5%; Wattage: 1/16W; Package: 0402; Distributor_name: DIGIKEY; Distributor_part_number: 311-4.7KJRCT-ND; Height: 0.40MM; Weight: 0.65mg; Temperature: -55癈+155癈; Datasheet: Y:\MIS_DATABASE\DATASHEETS\RESISTORS\RCXXXXL-SER_MAR18.PDF; Crtd /date: VASANTHA/130516; Chkd/date: VASANTHA/130516; Library Ref: RESISTOR; PCB Footprint: RES0402_0-5
R354 R358 = RESISTOR_Dup6: RES 4.7K 1/16W 5% 0402; Part_type: RESISTORS\FIXED; Mfr_part_number: RC0402JR-074K7L; Mfr_name: YAGEO AMERICA; Mistral Part No: 110011060001-R; Custom_Duty: 15%; Customs_HS_Code: 85332119; Voltage: NA; Project: TMDXCSK368; PCB Footprint: RES0402_0-5; Chkd/date: VASANTHA/130516; Crtd /date: VASANTHA/130516; Datasheet: Y:\MIS_DATABASE\DATASHEETS\RESISTORS\RCXXXXL-SER_MAR18.PDF; Temperature: -55癈+155癈; Weight: 0.65mg; Height: 0.40MM; Distributor_part_number: 311-4.7KJRCT-ND; Distributor_name: DIGIKEY; Package: 0402; Wattage: 1/16W; Tolerance: 5%; Library Ref: RESISTOR; Footprint Ref: RES0402_0-5; MECHANICAL 3D STEP FILE: RES0402_0-5; Library Path: Y:\MIS_DATABASE\Library\ALTIUM_TOOL\SCHEMATICS_PARTS\MS_DISCRETE_Library.schlib; Footprint Path: Y:\MIS_DATABASE\Library\ALTIUM_TOOL\PCB_FOOTPRINTS\Altium_Footprint_Lib.PcbLib
R516 = RESISTOR_Dup6: RES 100K 1/16W 5% 0402; Part_type: RESISTORS\FIXED; Mfr_part_number: CRCW0402100KJNED; Mfr_name: VISHAY; Mistral Part No: 110011060002-R; Custom_Duty: 15%; Customs_HS_Code: 85332119; Voltage: NA; Project: AM4515_EVM_LCD; PCB Footprint: RES0402_0-5; Footprint Path: Y:\MIS_DATABASE\Library\ALTIUM_TOOL\PCB_FOOTPRINTS\Altium_Footprint_Lib.PcbLib; Library Path: Y:\MIS_DATABASE\Library\ALTIUM_TOOL\SCHEMATICS_PARTS\MS_DISCRETE_Library.schlib; Footprint Ref: RES0402_0-5; Library Ref: RESISTOR; MECHANICAL 3D STEP FILE: RES0402_0-5; Chkd/date: VASANTHA/061216; Crtd /date: BAVISH/010611; Datasheet: Y:\MIS_DATABASE\DATASHEETS\RESISTORS\CRCW0603.PDF; Temperature: -55癈+155癈; Weight: 0.65mg; Height: 0.40MM; Distributor_part_number: 541-100KJCT-ND; Distributor_name: DIGIKEY; Package: 0402; Wattage: 1/16W; Tolerance: 5%
R538 = RESISTOR_Dup4: RES 4.7K 1/16W 5% 0402; Part_type: RESISTORS\FIXED; Mfr_part_number: RC0402JR-074K7L; Mfr_name: YAGEO AMERICA; Mistral Part No: 110011060001-R; Custom_Duty: 15%; Customs_HS_Code: 85332119; Voltage: NA; Project: TMDXCSK368; PCB Footprint: RES0402_0-5; Footprint Path: Y:\MIS_DATABASE\Library\ALTIUM_TOOL\PCB_FOOTPRINTS\Altium_Footprint_Lib.PcbLib; Library Path: Y:\MIS_DATABASE\Library\ALTIUM_TOOL\SCHEMATICS_PARTS\MS_DISCRETE_Library.schlib; MECHANICAL 3D STEP FILE: RES0402_0-5; Footprint Ref: RES0402_0-5; Library Ref: RESISTOR; Chkd/date: VASANTHA/130516; Crtd /date: VASANTHA/130516; Datasheet: Y:\MIS_DATABASE\DATASHEETS\RESISTORS\RCXXXXL-SER_MAR18.PDF; Temperature: -55癈+155癈; Weight: 0.65mg; Height: 0.40MM; Distributor_part_number: 311-4.7KJRCT-ND; Distributor_name: DIGIKEY; Package: 0402; Wattage: 1/16W; Tolerance: 5%
R541 = RESISTOR_Dup1: RES 820K 1/10W 1% 0402; Mistral Part No: 110009080033-R; Mfr_name: PANASONIC-ECG; Mfr_part_number: ERJ-2RKF8203X; Part_type: RESISTORS\FIXED; Project: BUG_BASE-II; Voltage: NA; Customs_HS_Code: 85332119; Custom_Duty: 15%; PCB Footprint: RES0402_0-5; Footprint Ref: RES0402_0-5; Tolerance: 1%; Wattage: 1/10W; Package: 0402; Distributor_name: DIGIKEY; Distributor_part_number: P820KLCT-ND; Library Ref: RESISTOR; Height: 0.40MM; Weight: 0.8mg; Temperature: -55癈+155癈; Datasheet: Y:\MIS_DATABASE\DATASHEETS\RESISTORS\PAN-ERJSER_NOV17.PDF; Crtd /date: MAZHAR/310809; Chkd/date: SUHAS/270910; MECHANICAL 3D STEP FILE: RES0402_0-5; Library Path: Y:\MIS_DATABASE\Library\ALTIUM_TOOL\SCHEMATICS_PARTS\MS_DISCRETE_Library.schlib; Footprint Path: Y:\MIS_DATABASE\Library\ALTIUM_TOOL\PCB_FOOTPRINTS\Altium_Footprint_Lib.PcbLib
R598 R599 = RESISTOR_Dup1: RES 620E 1/10W 1% 0402; Part_type: RESISTORS\FIXED; Mfr_part_number: ERJ-2RKF6200X; Mfr_name: PANASONIC-ECG; Mistral Part No: 110012090013-R; Custom_Duty: 15%; Customs_HS_Code: 85332119; Voltage: NA; Project: ITS-CONTROLER_CARD; Footprint Path: Y:\MIS_DATABASE\Library\ALTIUM_TOOL\PCB_FOOTPRINTS\Altium_Footprint_Lib.PcbLib; Library Path: Y:\MIS_DATABASE\Library\ALTIUM_TOOL\SCHEMATICS_PARTS\MS_DISCRETE_Library.schlib; MECHANICAL 3D STEP FILE: RES0402_0-5; Chkd/date: USMAN/120313; Crtd /date: CHAITHANYA/270912; Datasheet: Y:\MIS_DATABASE\DATASHEETS\RESISTORS\PAN-ERJSER_NOV17.PDF; Temperature: -55癈+155癈; Weight: 0.8mg; Height: 0.40MM; Library Ref: RESISTOR; Distributor_part_number: P620LCT-ND; Distributor_name: DIGIKEY; Package: 0402; Wattage: 1/10W; Tolerance: 1%; Footprint Ref: RES0402_0-5; PCB Footprint: RES0402_0-5
TP13 TP57 TP74 TP76 = TESTPOINT: TESTPOINT CIR 20 SMD; Mfr_name: LOCAL; Mistral Part No: NA; Project: BT MODULE_CSRBC04; PCB Footprint: TP20_SMD; RoHS: NA; Chkd/date: SHREESHAIL/171006; Crtd /date: MAZHAR/171006; Height: NA; Distributor_part_number: NA; Distributor_name: NA; Package: SMD; Part_type: TESTPOINT; Mfr_part_number: TP20_SMD; Tolerance: NA; Voltage: NA; Wattage: NA; Weight: NA; Temperature: NA; Datasheet: NA; MECHANICAL 3D STEP FILE: NA; Library Path: Y:\MIS_DATABASE\Library\ALTIUM_TOOL\SCHEMATICS_PARTS\MS_DISCRETE_Library.schlib; Footprint Path: Y:\MIS_DATABASE\Library\ALTIUM_TOOL\PCB_FOOTPRINTS\Altium_Footprint_Lib.PcbLib; Library Ref: TESTPOINT; Footprint Ref: TP20_SMD; Customs_HS_Code: NA; Custom_Duty: NA
TP30 TP65 TP71 TP75 = TESTPOINT: as TP22 on sheet 27; PCB Footprint: TP20_SMD; Footprint Path: Y:\MIS_DATABASE\Library\ALTIUM_TOOL\PCB_FOOTPRINTS\Altium_Footprint_Lib.PcbLib; Library Path: Y:\MIS_DATABASE\Library\ALTIUM_TOOL\SCHEMATICS_PARTS\MS_DISCRETE_Library.schlib; Datasheet: NA; Temperature: NA; Weight: NA; Wattage: NA; Voltage: NA; Tolerance: NA; Chkd/date: SHREESHAIL/171006; Crtd /date: MAZHAR/171006; Height: NA; Distributor_part_number: NA; Distributor_name: NA; Package: SMD; Part_type: TESTPOINT; Mfr_part_number: TP20_SMD; Mistral Part No: NA; Library Ref: TESTPOINT; Footprint Ref: TP20_SMD; RoHS: NA; Customs_HS_Code: NA; Custom_Duty: NA
TP66 TP73 TP77 TP79 TP80 = TESTPOINT: TESTPOINT CIR 20 SMD; Mfr_name: LOCAL; Custom_Duty: NA; Project: BT MODULE_CSRBC04; PCB Footprint: TP20_SMD; Customs_HS_Code: NA; RoHS: NA; Footprint Ref: TP20_SMD; Library Ref: TESTPOINT; Footprint Path: Y:\MIS_DATABASE\Library\ALTIUM_TOOL\PCB_FOOTPRINTS\Altium_Footprint_Lib.PcbLib; Library Path: Y:\MIS_DATABASE\Library\ALTIUM_TOOL\SCHEMATICS_PARTS\MS_DISCRETE_Library.schlib; MECHANICAL 3D STEP FILE: NA; Datasheet: NA; Temperature: NA; Weight: NA; Wattage: NA; Voltage: NA; Tolerance: NA; Chkd/date: SHREESHAIL/171006; Crtd /date: MAZHAR/171006; Height: NA; Distributor_part_number: NA; Distributor_name: NA; Package: SMD; Part_type: TESTPOINT; Mfr_part_number: TP20_SMD; Mistral Part No: NA
TP100 = TESTPOINT: as TP20 on sheet 27; PCB Footprint: TP20_SMD; RoHS: NA; Footprint Ref: TP20_SMD; Library Ref: TESTPOINT; Mfr_part_number: TP20_SMD; Part_type: TESTPOINT; Package: SMD; Distributor_name: NA; Distributor_part_number: NA; Height: NA; Crtd /date: MAZHAR/171006; Chkd/date: SHREESHAIL/171006; Tolerance: NA; Voltage: NA; Wattage: NA; Weight: NA; Temperature: NA; Datasheet: NA; MECHANICAL 3D STEP FILE: NA; Library Path: Y:\MIS_DATABASE\Library\ALTIUM_TOOL\SCHEMATICS_PARTS\MS_DISCRETE_Library.schlib; Footprint Path: Y:\MIS_DATABASE\Library\ALTIUM_TOOL\PCB_FOOTPRINTS\Altium_Footprint_Lib.PcbLib; Customs_HS_Code: NA; Custom_Duty: NA
U3 U4 = TCAN1042HGVD_SOIC8: IC FAULT PROTECTED CAN TRANSCEIVER WITH CAN FD SOIC8; Part_type: ICS\TELECOM\TRANSCEIVER; Mfr_name: TEXAS INSTRUMENTS; Mistral Part No: 143017070001-R; Custom_Duty: 15%; Customs_HS_Code: 85423100; Wattage: NA; Project: TI_SVB_CONTROLLER CARD; Footprint Path: Y:\MIS_DATABASE\Library\ALTIUM_TOOL\PCB_FOOTPRINTS\Altium_Footprint_Lib.PcbLib; Library Path: Y:\MIS_DATABASE\Library\ALTIUM_TOOL\SCHEMATICS_PARTS\MS_TELECOM_Library.schlib; Library Ref: TCAN1042HGVD_SOIC8; Footprint Ref: SOIC8_1-8; MECHANICAL 3D STEP FILE: SOIC8_1-8; Chkd/date: MANIRAJA/030717; Crtd /date: MANIRAJA/030717; Datasheet: Y:\MIS_DATABASE\DATASHEETS\ICS\DIGITAL\BUSTRANSCEIVER\TCAN1042.PDF; Temperature: -55癈+125癈; Weight: 540mg; Height: 1.75MM; Distributor_part_number: 296-43979-5-ND; Distributor_name: DIGIKEY; Package: SOIC8; Voltage: NA; Tolerance: NA; Mfr_part_number: TCAN1042HGVD; PCB Footprint: SOIC8_1-8
U23 = XAM6442BSFGGAALV_BGA441: as U23 on sheet 27; PCB Footprint: FCBGA441_31-49_680X680_2-6; Footprint Ref: FCBGA441_31-49_680X680_2-6; Mfr_part_number: AM6442BSFGHAALV; Voltage: NA; Wattage: NA; Package: BGA441; Distributor_name: NA; Distributor_part_number: NA; Library Ref: XAM6442BSFGGAALV_BGA441; Height: 2.57MM; Weight: NA; Temperature: NA; Datasheet: Y:\MIS_DATABASE\DATASHEETS\ICS\DIGITAL\MICROCONTROLLER\AM64-SoC_SVB.PDF; Crtd /date: ALVY/300322; Chkd/date: ALVY/300322; RoHS: NA; MECHANICAL 3D STEP FILE: FCBGA441_31-49_680X680_2-6; Library Path: Y:\MIS_DATABASE\Library\ALTIUM_TOOL\SCHEMATICS_PARTS\MS_MICROPROCESSOR_Library.schlib; Footprint Path: Y:\MIS_DATABASE\Library\ALTIUM_TOOL\PCB_FOOTPRINTS\Altium_Footprint_Lib.PcbLib
U67 = SN74CB3Q3257PWR_TSSOP16: IC 4BIT 1-OF-2 FET MULTIPLEXER/DEMULTIPLEXER TSSOP16; Part_type: ICS\DIGITAL\COMBINATIONAL; Mfr_name: TEXAS INSTRUMENTS; Mistral Part No: 141009030117-R; Custom_Duty: 15%; Customs_HS_Code: 85423100; Project: OMAP_EVM; RoHS: Sb/ Br FREE; Chkd/date: SUHAS/251010; Crtd /date: USMAN/060109; Datasheet: Y:\MIS_DATABASE\DATASHEETS\ICS\DIGITAL\COMBINATIONAL\SN74CB3Q3257.PDF; Temperature: -40癈+85癈; Height: 1.20MM; Distributor_part_number: 296-19138-1-ND; Distributor_name: DIGIKEY; Package: TSSOP16; Mfr_part_number: SN74CB3Q3257PWR; Library Ref: SN74CB3Q3257PWR_TSSOP16; PCB Footprint: TSSOP16_25-59_205X180
U83 = 93LC46B_MSOP8: IC 1K MICROWIRE COMPATIBLE SERIAL EEPROM MSOP8; Part_type: ICS\DIGITAL\MEMORY; Mfr_part_number: 93LC46B-I/MS; Mfr_name: MICROCHIP; Mistral Part No: 141118020002-R; Custom_Duty: 15%; Customs_HS_Code: 85423100; Wattage: NA; Project: TI_MAXIE_CPB; Footprint Path: Y:\MIS_DATABASE\Library\ALTIUM_TOOL\PCB_FOOTPRINTS\Altium_Footprint_Lib.PcbLib; Library Path: Y:\MIS_DATABASE\Library\ALTIUM_TOOL\SCHEMATICS_PARTS\MS_MISCMEMORY_Library.schlib; MECHANICAL 3D STEP FILE: MSOP8_25-59_125X125_1-1; Chkd/date: MANIRAJA/150218; Crtd /date: ALVY/150218; Datasheet: Y:\MIS_DATABASE\DATASHEETS\ICS\MEMORY\93LC46B.PDF; Temperature: -40癈+85癈; Weight: 140mg; Height: 1.10MM; Distributor_part_number: 93LC46B-I/MS-ND; Distributor_name: DIGIKEY; Package: MSOP8; Voltage: NA; Tolerance: NA; Library Ref: 93LC46B_MSOP8; Footprint Ref: MSOP8_25-59_125X125_1-1; PCB Footprint: MSOP8_25-59_125X125_1-1
U99 = TPS22945DCKR_SC70-5: IC LOW INPUT VOLTAGE CURRENT LIMITED LOAD SWITCH SC70-5; Mistral Part No: 142009030143-R; Mfr_name: TEXAS INSTRUMENTS; Part_type: ICS\POWER; Project: AXON; Tolerance: NA; Customs_HS_Code: 85423100; Custom_Duty: 15%; PCB Footprint: SC70-5_1-1; Mfr_part_number: TPS22945DCKR; Voltage: NA; Wattage: NA; Package: SC70-5; Distributor_name: DIGIKEY; Distributor_part_number: 296-24475-1-ND; Library Ref: TPS22945DCKR_SC70-5; Height: 1.10MM; Weight: 2.5mg; Temperature: -40癈+85癈; Datasheet: Y:\MIS_DATABASE\DATASHEETS\ICS\POWER\TPS2294.PDF; Crtd /date: USMAN/020409; Chkd/date: VASANTHA/010117; MECHANICAL 3D STEP FILE: SC70-5_1-1